# Altium schematic sheet screen.SchDoc
size A4; SheetNumber: 1; SheetTotal: 4
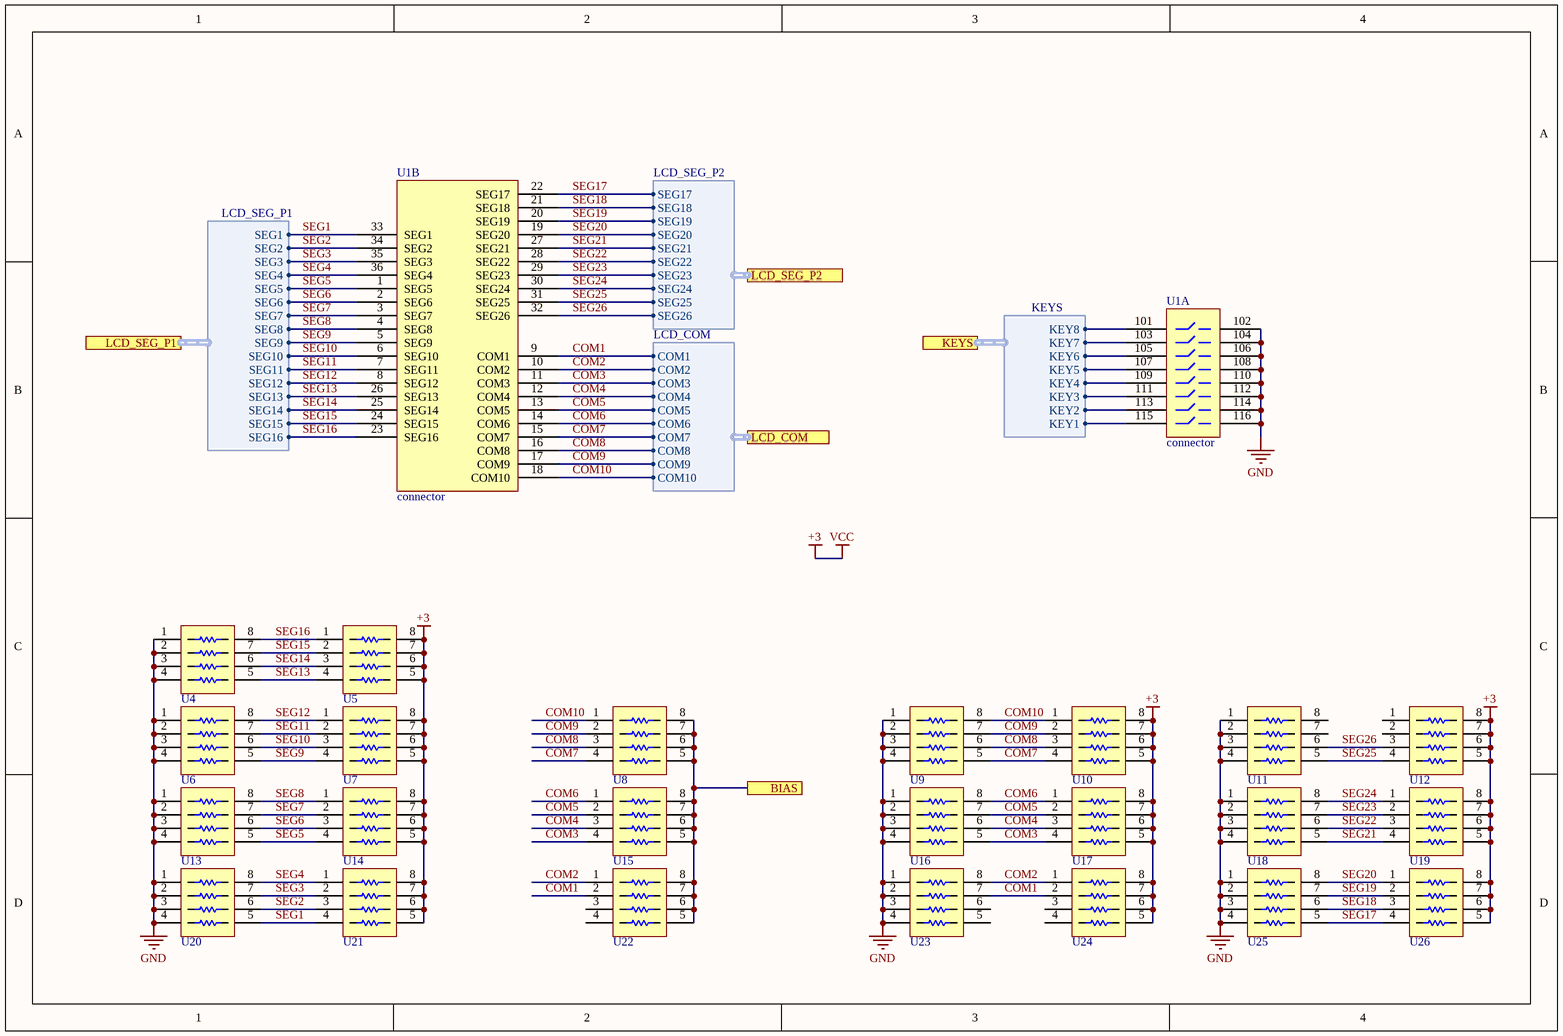
[diagram p0: screen.SchDoc]

## Parts
U1  connector  [kunborad]  (parts A,B of 2)
U4  RES_BATCH  [0603_RES_BATCH]  (value not drawn)
U5  RES_BATCH  [0603_RES_BATCH]  (value not drawn)
U6  RES_BATCH  [0603_RES_BATCH]  (value not drawn)
U7  RES_BATCH  [0603_RES_BATCH]  (value not drawn)
U8  RES_BATCH  [0603_RES_BATCH]  (value not drawn)
U9  RES_BATCH  [0603_RES_BATCH]  (value not drawn)
U10  RES_BATCH  [0603_RES_BATCH]  (value not drawn)
U11  RES_BATCH  [0603_RES_BATCH]  (value not drawn)
U12  RES_BATCH  [0603_RES_BATCH]  (value not drawn)
U13  RES_BATCH  [0603_RES_BATCH]  (value not drawn)
U14  RES_BATCH  [0603_RES_BATCH]  (value not drawn)
U15  RES_BATCH  [0603_RES_BATCH]  (value not drawn)
U16  RES_BATCH  [0603_RES_BATCH]  (value not drawn)
U17  RES_BATCH  [0603_RES_BATCH]  (value not drawn)
U18  RES_BATCH  [0603_RES_BATCH]  (value not drawn)
U19  RES_BATCH  [0603_RES_BATCH]  (value not drawn)
U20  RES_BATCH  [0603_RES_BATCH]  (value not drawn)
U21  RES_BATCH  [0603_RES_BATCH]  (value not drawn)
U22  RES_BATCH  [0603_RES_BATCH]  (value not drawn)
U23  RES_BATCH  [0603_RES_BATCH]  (value not drawn)
U24  RES_BATCH  [0603_RES_BATCH]  (value not drawn)
U25  RES_BATCH  [0603_RES_BATCH]  (value not drawn)
U26  RES_BATCH  [0603_RES_BATCH]  (value not drawn)

## Ports
BIAS, KEYS (harness KEYS), LCD_COM (harness LCD_COM), LCD_SEG_P1 (harness LCD_SEG_P1), LCD_SEG_P2 (harness LCD_SEG_P2)

## Harnesses
LCD_COM: COM10, COM9, COM8, COM7, COM6, COM5, COM4, COM3, COM2, COM1
LCD_SEG_P1: SEG8, SEG7, SEG6, SEG5, SEG4, SEG3, SEG2, SEG1, SEG9, SEG16, SEG15, SEG14, SEG13, SEG12, SEG11, SEG10
LCD_SEG_P2: SEG21, SEG20, SEG19, SEG18, SEG17, SEG26, SEG25, SEG24, SEG23, SEG22
KEYS: KEY1, KEY2, KEY3, KEY4, KEY5, KEY6, KEY7, KEY8

## Nets
+3: U5.5 U5.6 U5.7 U5.8 U7.5 U7.6 U7.7 U7.8 U10.5 U10.6 U10.7 U10.8 U12.5 U12.6 U12.7 U12.8 U14.5 U14.6 U14.7 U14.8 U17.5 U17.6 U17.7 U17.8 U19.5 U19.6 U19.7 U19.8 U21.5 U21.6 U21.7 U21.8 U24.5 U24.6 U24.7 U24.8 U26.5 U26.6 U26.7 U26.8  [also labelled VCC]
GND: U1.102 U1.104 U1.106 U1.108 U1.110 U1.112 U1.114 U1.116 U4.1 U4.2 U4.3 U4.4 U6.1 U6.2 U6.3 U6.4 U9.1 U9.2 U9.3 U9.4 U11.1 U11.2 U11.3 U11.4 U13.1 U13.2 U13.3 U13.4 U16.1 U16.2 U16.3 U16.4 U18.1 U18.2 U18.3 U18.4 U20.1 U20.2 U20.3 U20.4 U23.1 U23.2 U23.3 U23.4 U25.1 U25.2 U25.3 U25.4
BIAS: U8.5 U8.6 U8.7 U8.8 U15.5 U15.6 U15.7 U15.8 U22.5 U22.6 U22.7 U22.8 ; port BIAS
COM1: U1.9(COM1) U22.2 U23.7 U24.2 ; port LCD_COM.COM1
COM2: U1.10(COM2) U22.1 U23.8 U24.1 ; port LCD_COM.COM2
COM3: U1.11(COM3) U15.4 U16.5 U17.4 ; port LCD_COM.COM3
COM4: U1.12(COM4) U15.3 U16.6 U17.3 ; port LCD_COM.COM4
COM5: U1.13(COM5) U15.2 U16.7 U17.2 ; port LCD_COM.COM5
COM6: U1.14(COM6) U15.1 U16.8 U17.1 ; port LCD_COM.COM6
COM7: U1.15(COM7) U8.4 U9.5 U10.4 ; port LCD_COM.COM7
COM8: U1.16(COM8) U8.3 U9.6 U10.3 ; port LCD_COM.COM8
COM9: U1.17(COM9) U8.2 U9.7 U10.2 ; port LCD_COM.COM9
COM10: U1.18(COM10) U8.1 U9.8 U10.1 ; port LCD_COM.COM10
SEG1: U1.33(SEG1) U20.5 U21.4 ; port LCD_SEG_P1.SEG1
SEG2: U1.34(SEG2) U20.6 U21.3 ; port LCD_SEG_P1.SEG2
SEG3: U1.35(SEG3) U20.7 U21.2 ; port LCD_SEG_P1.SEG3
SEG4: U1.36(SEG4) U20.8 U21.1 ; port LCD_SEG_P1.SEG4
SEG5: U1.1(SEG5) U13.5 U14.4 ; port LCD_SEG_P1.SEG5
SEG6: U1.2(SEG6) U13.6 U14.3 ; port LCD_SEG_P1.SEG6
SEG7: U1.3(SEG7) U13.7 U14.2 ; port LCD_SEG_P1.SEG7
SEG8: U1.4(SEG8) U13.8 U14.1 ; port LCD_SEG_P1.SEG8
SEG9: U1.5(SEG9) U6.5 U7.4 ; port LCD_SEG_P1.SEG9
SEG10: U1.6(SEG10) U6.6 U7.3 ; port LCD_SEG_P1.SEG10
SEG11: U1.7(SEG11) U6.7 U7.2 ; port LCD_SEG_P1.SEG11
SEG12: U1.8(SEG12) U6.8 U7.1 ; port LCD_SEG_P1.SEG12
SEG13: U1.26(SEG13) U4.5 U5.4 ; port LCD_SEG_P1.SEG13
SEG14: U1.25(SEG14) U4.6 U5.3 ; port LCD_SEG_P1.SEG14
SEG15: U1.24(SEG15) U4.7 U5.2 ; port LCD_SEG_P1.SEG15
SEG16: U1.23(SEG16) U4.8 U5.1 ; port LCD_SEG_P1.SEG16
SEG17: U1.22(SEG17) U25.5 U26.4 ; port LCD_SEG_P2.SEG17
SEG18: U1.21(SEG18) U25.6 U26.3 ; port LCD_SEG_P2.SEG18
SEG19: U1.20(SEG19) U25.7 U26.2 ; port LCD_SEG_P2.SEG19
SEG20: U1.19(SEG20) U25.8 U26.1 ; port LCD_SEG_P2.SEG20
SEG21: U1.27(SEG21) U18.5 U19.4 ; port LCD_SEG_P2.SEG21
SEG22: U1.28(SEG22) U18.6 U19.3 ; port LCD_SEG_P2.SEG22
SEG23: U1.29(SEG23) U18.7 U19.2 ; port LCD_SEG_P2.SEG23
SEG24: U1.30(SEG24) U18.8 U19.1 ; port LCD_SEG_P2.SEG24
SEG25: U1.31(SEG25) U11.5 U12.4 ; port LCD_SEG_P2.SEG25
SEG26: U1.32(SEG26) U11.6 U12.3 ; port LCD_SEG_P2.SEG26
NetU1_101: U1.101 ; port KEYS.KEY8
NetU1_103: U1.103 ; port KEYS.KEY7
NetU1_105: U1.105 ; port KEYS.KEY6
NetU1_107: U1.107 ; port KEYS.KEY5
NetU1_109: U1.109 ; port KEYS.KEY4
NetU1_111: U1.111 ; port KEYS.KEY3
NetU1_113: U1.113 ; port KEYS.KEY2
NetU1_115: U1.115 ; port KEYS.KEY1

Not connected (* = marked no-connect by the designer): U11 7 8; U12 1 2; U22 3 4; U23 5 6; U24 3 4

## Library data of the parts
U1 = kunboard